# EAGLE schematic IR_LED_PD (EAGLE 9.7.0)
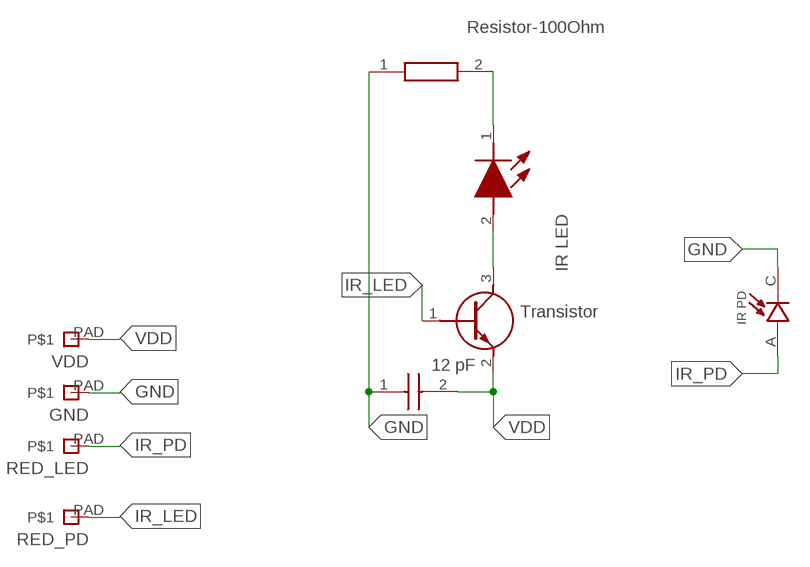
[diagram p0: schematic, sheet 1]

## Parts
C1  CAPACITOR-12PF  [CAPC1005X55N]
D1  IRPD  [XDCR_VEMD2023X01]
GND  PAD  [PAD]
LED1  IRLED  [LEDC3216X180N]
Q1  TRANSISTOR  [SOT883B]
R1  RESISTOR-100OHM  [RESC1608X55N]
RED_LED  PAD  [PAD]
RED_PD  PAD  [PAD]
VDD  PAD  [PAD]

## Nets
GND: C1.1 D1.C GND.PAD R1.1
IR_LED: Q1.1(B) RED_PD.PAD
IR_PD: D1.A RED_LED.PAD
N$2: LED1.2(A) Q1.3(C)
N$3: LED1.1(K) R1.2
VDD: C1.2 Q1.2(E) VDD.PAD

## Library data of the parts
C1 = MABOS_Library:CAPACITOR-12PF: 12 pF; DESCRIPTION: Multilayer Ceramic Capacitors MLCC - SMD/SMT 12pF 2% 25V C0G; HEIGHT: 0.55mm; MANUFACTURER_NAME: Kemet; MANUFACTURER_PART_NUMBER: C0402C120G3GACTU; MOUSER_PART_NUMBER: 80-C0402C120G3G; MOUSER_PRICE-STOCK: https://www.mouser.com/Search/Refine.aspx?Keyword=80-C0402C120G3G
D1 = MABOS_Library:IRPD: Check availability <https://pricing.snapeda.com/parts/VEMD2023X01/Vishay%20Semiconductor/view-part?ref=eda>; AVAILABILITY: In Stock; DESCRIPTION: Photodiode 940nm 100ns 70° 2-SMD; MF: Vishay Semiconductor; MP: VEMD2023X01; PACKAGE: SMD-2 Vishay Semiconductor; PRICE: None; PURCHASE-URL: https://pricing.snapeda.com/search/part/VEMD2023X01/?ref=eda
GND RED_LED RED_PD VDD = Nordic_BLE:PAD
LED1 = MABOS_Library:IRLED: Infrared Emitters 3.2x1.6mm IR SMD LED Source: Datasheet <https://www.arrow.com/en/products/aptd3216f3c-p22/kingbright>; DESCRIPTION: Infrared Emitters 3.2x1.6mm IR SMD LED; HEIGHT: 1.8mm; MANUFACTURER_NAME: Kingbright; MANUFACTURER_PART_NUMBER: APTD3216F3C-P22; MOUSER_PART_NUMBER: 604-APTD3216F3C-P22; MOUSER_PRICE-STOCK: https://www.mouser.co.uk/ProductDetail/Kingbright/APTD3216F3C-P22?qs=fAHHVMwC%252Bbjo55EMkwMBzg%3D%3D
Q1 = MABOS_Library:TRANSISTOR: Bipolar Transistors - BJT 45V NPN 100mA 250mW Source: Datasheet <https://componentsearchengine.com/Datasheets/1/BC847BMB,315.pdf>; DESCRIPTION: Bipolar Transistors - BJT 45V NPN 100mA 250mW; HEIGHT: mm; MANUFACTURER_NAME: Nexperia; MANUFACTURER_PART_NUMBER: BC847BMB,315; MOUSER_PART_NUMBER: 771-BC847BMB315; MOUSER_PRICE-STOCK: https://www.mouser.co.uk/ProductDetail/Nexperia/BC847BMB315?qs=5C9Q4QJFsuN7bUmIcU4LYw%3D%3D
R1 = MABOS_Library:RESISTOR-100OHM: Thick Film Resistors - SMD 100 OHM .1% 50PPM Source: Datasheet; DESCRIPTION: Thick Film Resistors - SMD 100 OHM .1% 50PPM; HEIGHT: 0.55mm; MANUFACTURER_NAME: KOA Speer; MANUFACTURER_PART_NUMBER: RS73G1JTTD1000B; MOUSER_PART_NUMBER: 660-RS73G1JTTD1000B; MOUSER_PRICE-STOCK: https://www.mouser.co.uk/ProductDetail/KOA-Speer/RS73G1JTTD1000B/?qs=GBLSl2AkiruQBcK7exZ%252Bcg%3D%3D